# Altium schematic sheet 05_ZYNQ_ETHERNET.SchDoc
size 420 x 297 mm; SheetNumber: 5; SheetTotal: 7
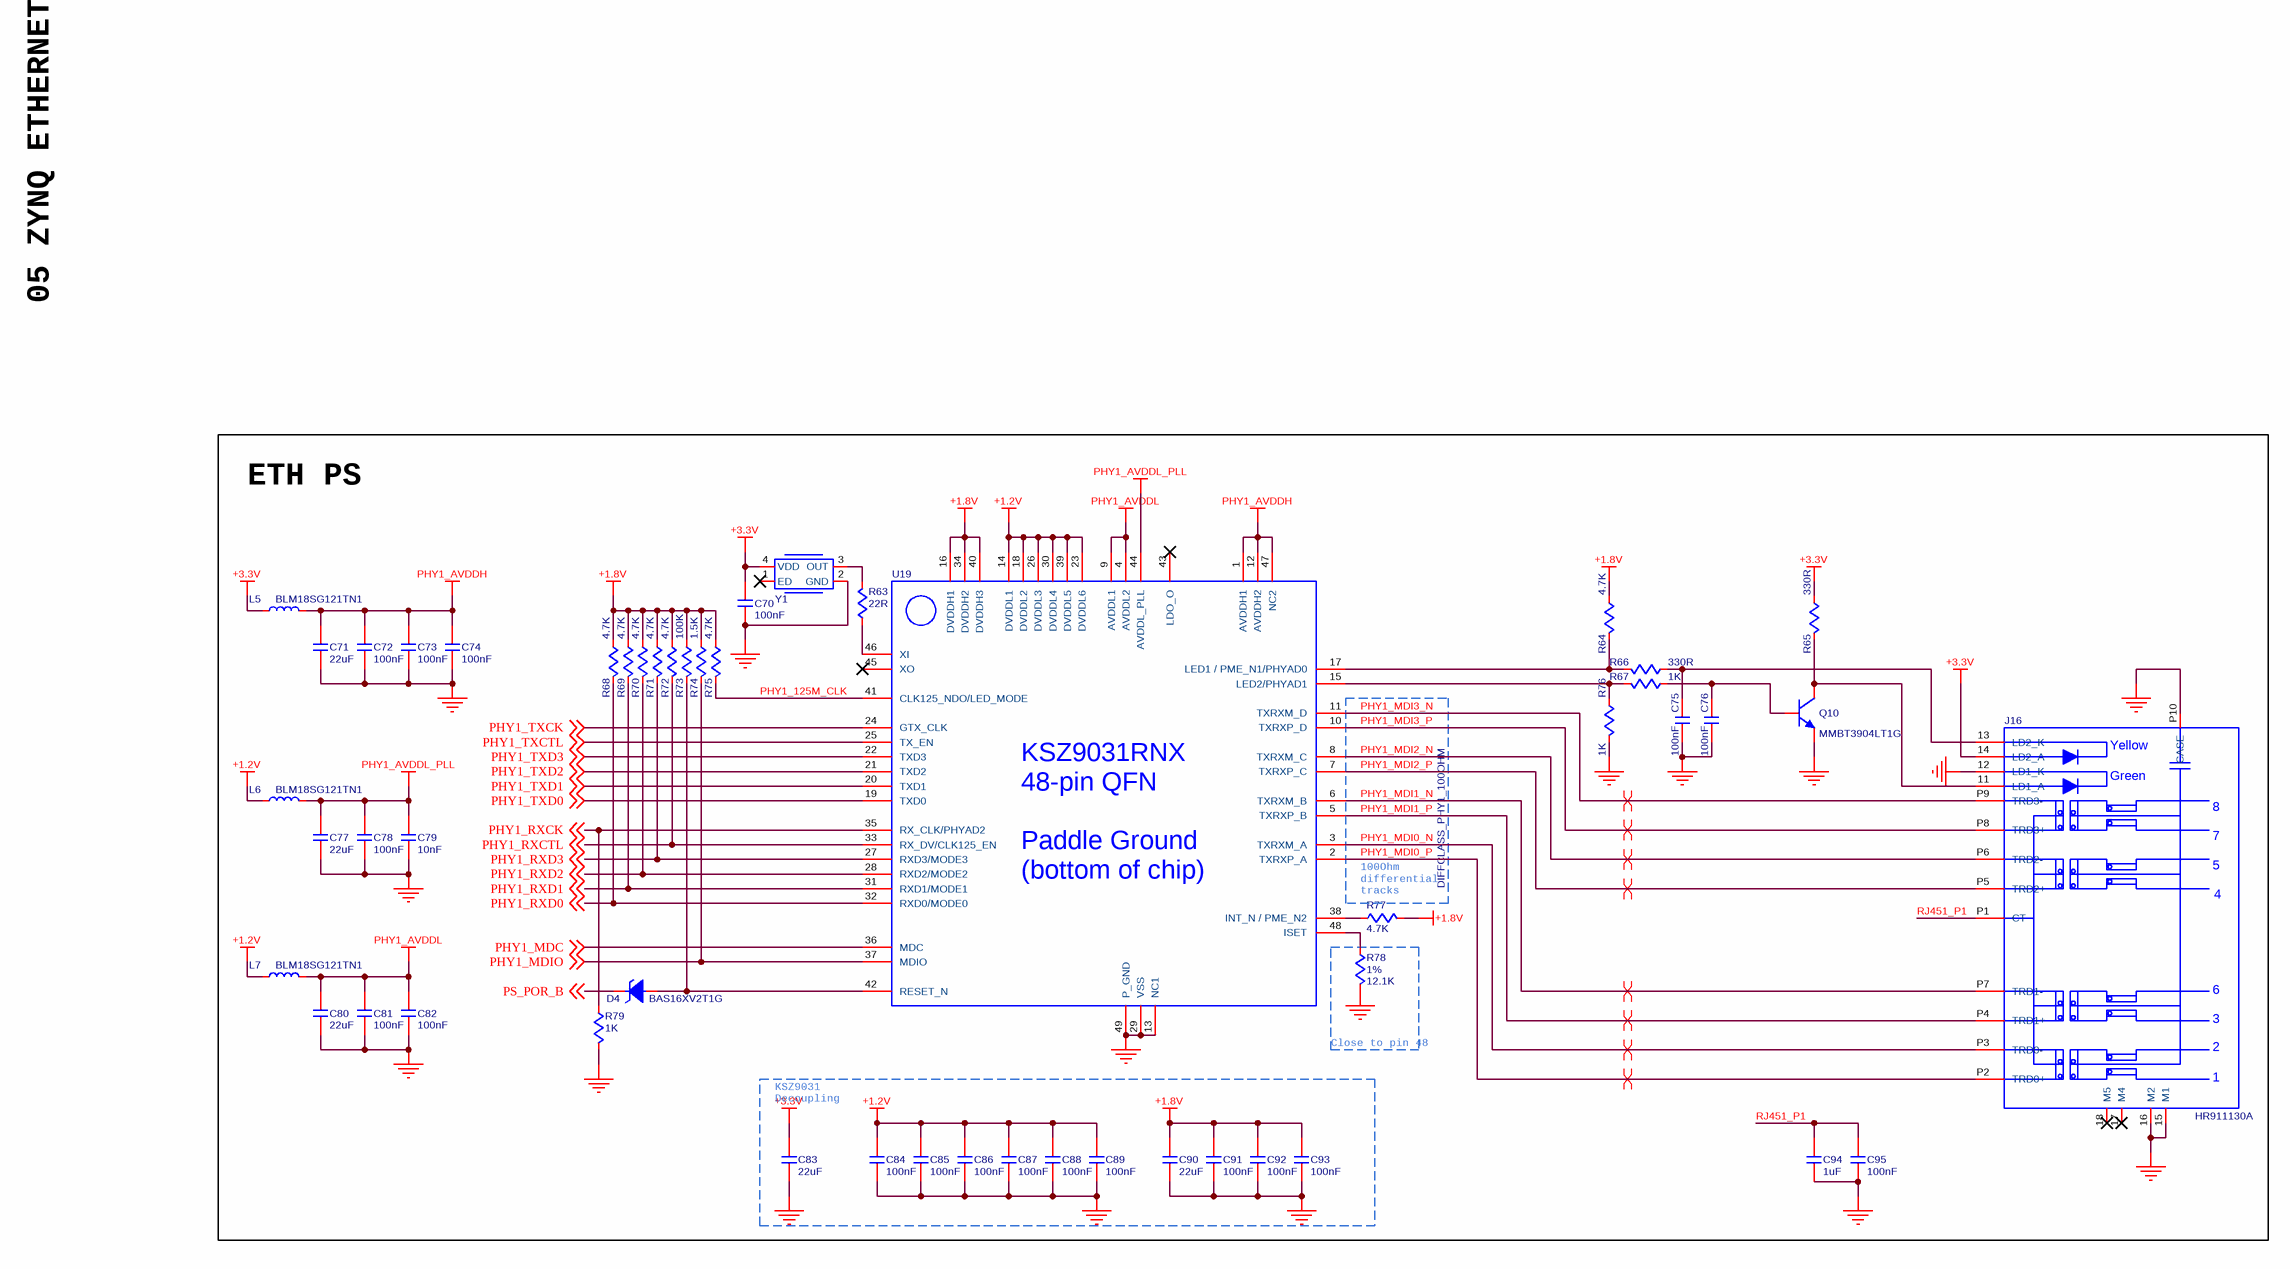
[diagram p0: 05_ZYNQ_ETHERNET.SchDoc]

## Parts
C70  value 100nF  [C0402]  (hidden comment: C-NOMO)
C71  value 22uF  [C0805]  (hidden comment: C-NOMO)
C72  value 100nF  [C0402]  (hidden comment: C-NOMO)
C73  value 100nF  [C0402]  (hidden comment: C-NOMO)
C74  value 100nF  [C0402]  (hidden comment: C-NOMO)
C75  value 100nF  [C0402]  (hidden comment: C-NOMO)
C76  value 100nF  [C0402]  (hidden comment: C-NOMO)
C77  value 22uF  [C0805]  (hidden comment: C-NOMO)
C78  value 100nF  [C0402]  (hidden comment: C-NOMO)
C79  value 10nF  [C0402]  (hidden comment: C-NOMO)
C80  value 22uF  [C0805]  (hidden comment: C-NOMO)
C81  value 100nF  [C0402]  (hidden comment: C-NOMO)
C82  value 100nF  [C0402]  (hidden comment: C-NOMO)
C83  value 22uF  [C0805]  (hidden comment: C-NOMO)
C84  value 100nF  [C0402]  (hidden comment: C-NOMO)
C85  value 100nF  [C0402]  (hidden comment: C-NOMO)
C86  value 100nF  [C0402]  (hidden comment: C-NOMO)
C87  value 100nF  [C0402]  (hidden comment: C-NOMO)
C88  value 100nF  [C0402]  (hidden comment: C-NOMO)
C89  value 100nF  [C0402]  (hidden comment: C-NOMO)
C90  value 22uF  [C0805]  (hidden comment: C-NOMO)
C91  value 100nF  [C0402]  (hidden comment: C-NOMO)
C92  value 100nF  [C0402]  (hidden comment: C-NOMO)
C93  value 100nF  [C0402]  (hidden comment: C-NOMO)
C94  value 1uF  [C0402]  (hidden comment: C-NOMO)
C95  value 100nF  [C0402]  (hidden comment: C-NOMO)
D4  BAS16XV2T1G  [SOD-523]
J16  HR911130A  [RJ45-GE]
L5  BLM18SG121TN1  [L0603]
L6  BLM18SG121TN1  [L0603]
L7  BLM18SG121TN1  [L0603]
Q10  MMBT3904LT1G  [SOT-23]
R63  value 22R  [R0402]  (hidden comment: R)
R64  value 4.7K  [R0402]  (hidden comment: R)
R65  value 330R  [R0402]  (hidden comment: R)
R66  value 330R  [R0402]  (hidden comment: R)
R67  value 1K  [R0402]  (hidden comment: R)
R68  value 4.7K  [R0402]  (hidden comment: R)
R69  value 4.7K  [R0402]  (hidden comment: R)
R70  value 4.7K  [R0402]  (hidden comment: R)
R71  value 4.7K  [R0402]  (hidden comment: R)
R72  value 4.7K  [R0402]  (hidden comment: R)
R73  value 100K  [R0402]  (hidden comment: R)
R74  value 1.5K  [R0402]  (hidden comment: R)
R75  value 4.7K  [R0402]  (hidden comment: R)
R76  value 1K  [R0402]  (hidden comment: R)
R77  value 4.7K  [R0402]  (hidden comment: R)
R78  value 12.1K  precision: 1%  [R0402]  (hidden comment: R)
R79  value 1K  [R0402]  (hidden comment: R)
U19  KSZ9031RNX  [KSZ9031]  (value not drawn)
Y1  XTAL  [OSC3225]  (value not drawn)

## Blocks framed on the sheet
ETH PS: C70-C95 D4 J16 L5-L7 Q10 R63-R79 U19 Y1

## Nets
+1.2V: C84.2 C85.2 C86.2 C87.2 C88.2 C89.2 L6.1 L7.1 U19.14(DVDDL1) U19.18(DVDDL2) U19.23(DVDDL6) U19.26(DVDDL3) U19.30(DVDDL4) U19.39(DVDDL5)
+1.8V: C90.2 C91.2 C92.2 C93.2 R64.2 R68.2 R69.2 R70.2 R71.2 R72.2 R73.2 R74.2 R75.2 R77.1 U19.16(DVDDH1) U19.34(DVDDH2) U19.40(DVDDH3)
+3.3V: C70.2 C83.2 J16.14(LD2_A) L5.1 R65.2 Y1.4(VDD)
GND: C70.1 C71.1 C72.1 C73.1 C74.1 C75.1 C76.1 C77.1 C78.1 C79.1 C80.1 C81.1 C82.1 C83.1 C84.1 C85.1 C86.1 C87.1 C88.1 C89.1 C90.1 C91.1 C92.1 C93.1 C94.1 C95.1 J16.12(LD1_K) J16.15(M1) J16.16(M2) J16.P10(CASE) Q10.2(E) R76.1 R78.1 R79.1 U19.13(NC1) U19.29(VSS) U19.49(P_GND) Y1.2(GND)
PHY1_AVDDH: C71.2 C72.2 C73.2 C74.2 L5.2 U19.1(AVDDH1) U19.12(AVDDH2) U19.47(NC2)
PHY1_AVDDL: C80.2 C81.2 C82.2 L7.2 U19.4(AVDDL2) U19.9(AVDDL1)
PHY1_AVDDL_PLL: C77.2 C78.2 C79.2 L6.2 U19.44(AVDDL_PLL)
PHY1_125M_CLK: R75.1 U19.41(CLK125_NDO/LED_MODE)
PHY1_MDC: U19.36(MDC) ; off-sheet PHY1_MDC
PHY1_MDI0_N: J16.P3(TRD0-) U19.3(TXRXM_A)
PHY1_MDI0_P: J16.P2(TRD0+) U19.2(TXRXP_A)
PHY1_MDI1_N: J16.P7(TRD1-) U19.6(TXRXM_B)
PHY1_MDI1_P: J16.P4(TRD1+) U19.5(TXRXP_B)
PHY1_MDI2_N: J16.P6(TRD2-) U19.8(TXRXM_C)
PHY1_MDI2_P: J16.P5(TRD2+) U19.7(TXRXP_C)
PHY1_MDI3_N: J16.P9(TRD3-) U19.11(TXRXM_D)
PHY1_MDI3_P: J16.P8(TRD3+) U19.10(TXRXP_D)
PHY1_MDIO: R74.1 U19.37(MDIO) ; off-sheet PHY1_MDIO
PHY1_RXCK: R79.2 U19.35(RX_CLK/PHYAD2) ; off-sheet PHY1_RXCK
PHY1_RXCTL: R72.1 U19.33(RX_DV/CLK125_EN) ; off-sheet PHY1_RXCTL
PHY1_RXD0: R68.1 U19.32(RXD0/MODE0) ; off-sheet PHY1_RXD0
PHY1_RXD1: R69.1 U19.31(RXD1/MODE1) ; off-sheet PHY1_RXD1
PHY1_RXD2: R70.1 U19.28(RXD2/MODE2) ; off-sheet PHY1_RXD2
PHY1_RXD3: R71.1 U19.27(RXD3/MODE3) ; off-sheet PHY1_RXD3
PHY1_TXCK: U19.24(GTX_CLK) ; off-sheet PHY1_TXCK
PHY1_TXCTL: U19.25(TX_EN) ; off-sheet PHY1_TXCTL
PHY1_TXD0: U19.19(TXD0) ; off-sheet PHY1_TXD0
PHY1_TXD1: U19.20(TXD1) ; off-sheet PHY1_TXD1
PHY1_TXD2: U19.21(TXD2) ; off-sheet PHY1_TXD2
PHY1_TXD3: U19.22(TXD3) ; off-sheet PHY1_TXD3
PS_POR_B: D4.1 ; off-sheet PS_POR_B
RJ451_P1: C94.2 C95.2 J16.P1(CT)
NetC75_2: C75.2 J16.13(LD2_K) R66.2
NetC76_2: C76.2 Q10.1(B) R67.2
NetD4_2: D4.2 R73.1 U19.42(RESET_N)
NetJ16_11: J16.11(LD1_A) Q10.3(C) R65.1
NetR63_1: R63.1 Y1.3(OUT)
NetR63_2: R63.2 U19.46(XI)
NetR64_1: R64.1 R66.1 U19.17(LED1_/_PME_N1/PHYAD0)
NetR67_1: R67.1 R76.2 U19.15(LED2/PHYAD1)
NetR77_2: R77.2 U19.38(INT_N_/_PME_N2)
NetR78_2: R78.2 U19.48(ISET)

Not connected (* = marked no-connect by the designer): J16 17(M4)* 18(M5)*; U19 43(LDO_O)* 45(XO)*; Y1 1(ED)*

## Layout directives
differential pair; differential pair class DIFFCLASS_PHY1_100OHM: PHY1_MDI0_N, PHY1_MDI0_P, PHY1_MDI1_N, PHY1_MDI1_P, PHY1_MDI2_N, PHY1_MDI2_P, PHY1_MDI3_N, PHY1_MDI3_P

## Notes on the sheet
- 05 ZYNQ ETHERNET
- (near R77) 100Ohm differential tracks
- KSZ9031 Decoupling
- Close to pin 48
- (in symbol KSZ9031RNX) KSZ9031RNX / 48-pin QFN / Paddle Ground / (bottom of chip)
- (in symbol RJ45-GE) Yellow; Green; 8; 7; 5; 4; 6; 3; 2; 1

## Library data of the parts
C70-C95 = C-NOMO: voltage: 25V; precision: 5%
D4 = DIOD2
J16 = RJ45-GE
L5-L7 = L: Code_IEC: 1005; Value: 10mH; Published: 8-Jun-2000; LatestRevisionDate: 29-May-2009; LatestRevisionNote: IPC-7351 Footprint Added.; PackageReference: 0402-A; Publisher: Altium Limited; PackageDescription: Chip Inductor; Code_JEITA: 0402
Q10 = NPN
R63-R77 R79 = R: precision: 1%
Y1 = XTAL: frequency: 25MHZ